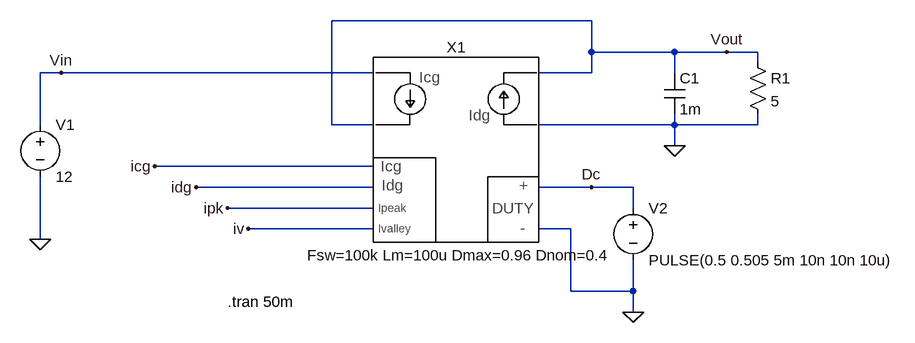
[diagram p0: schematic Test_Jig.asc]
Test_Jig.asc, the LTspice schematic file:
Version 4
SHEET 1 888 680
WIRE 400 -16 0 -16
WIRE 400 32 400 -16
WIRE 528 32 400 32
WIRE 608 32 528 32
WIRE 656 32 608 32
WIRE 656 48 656 32
WIRE -416 64 -448 64
WIRE 64 64 -416 64
WIRE 400 64 400 32
WIRE 400 64 320 64
WIRE 528 64 528 32
WIRE -448 144 -448 64
WIRE 0 144 0 -16
WIRE 64 144 0 144
WIRE 528 144 528 128
WIRE 528 144 320 144
WIRE 656 144 656 128
WIRE 656 144 528 144
WIRE 528 176 528 144
WIRE 64 208 -272 208
WIRE 64 240 -208 240
WIRE 400 240 320 240
WIRE 464 240 400 240
WIRE 64 272 -160 272
WIRE 464 272 464 240
WIRE 64 304 -128 304
WIRE 368 304 320 304
WIRE -448 320 -448 224
WIRE 368 400 368 304
WIRE 464 400 464 352
WIRE 464 400 368 400
WIRE 464 432 464 400
FLAG 528 176 0
FLAG -448 320 0
FLAG 464 432 0
FLAG 608 32 Vout
FLAG -416 64 Vin
FLAG 400 240 Dc
FLAG -272 208 icg
FLAG -208 240 idg
FLAG -160 272 ipk
FLAG -128 304 iv
DATAFLAG -208 208 ""
DATAFLAG -112 240 ""
DATAFLAG -112 272 ""
DATAFLAG -32 304 ""
SYMBOL cap 512 64 R0
SYMATTR InstName C1
SYMATTR Value 1m
SYMBOL res 640 32 R0
SYMATTR InstName R1
SYMATTR Value 5
SYMBOL voltage -448 128 R0
WINDOW 123 0 0 Left 0
WINDOW 39 0 0 Left 0
SYMATTR InstName V1
SYMATTR Value 12
SYMBOL voltage 464 256 R0
WINDOW 123 0 0 Left 0
WINDOW 39 0 0 Left 0
SYMATTR InstName V2
SYMATTR Value PULSE(0.5 0.505 5m 10n 10n 10u)
SYMBOL Duty_Control_IRM 192 144 R0
WINDOW 39 -229 201 Left 2
SYMATTR SpiceLine Fsw=100k Lm=100u Dmax=0.96 Dnom=0.4
SYMATTR InstName X1
TEXT -160 416 Left 2 !.tran 50m

The netlist it stands for:
* Test_Jig.asc
C1 Vout 0 1m
R1 Vout 0 5
V1 Vin 0 12
V2 Dc 0 PULSE(0.5 0.505 5m 10n 10n 10u)
XX1 Dc 0 Vin Vout Vout 0 icg idg ipk iv Duty_Control_IRM params: Fsw=100k Lm=100u Dmax=0.96 Dnom=0.4  ; pins D+ D- Vcg+ Vcg- Vdg+ Vdg- Icharge Idischarge Ipeak Ivalley
.tran 50m
.backanno
.end